# Altium schematic sheet FPGA.SchDoc: iCEVision - FPGA
size A4; Organization: DPControl srl; Address1: via Napoli, 55; Address2: 84014 - Nocera Inf.re; Address3: Salerno; Address4: Italy; Revision: 1; SheetNumber: 1; SheetTotal: 3
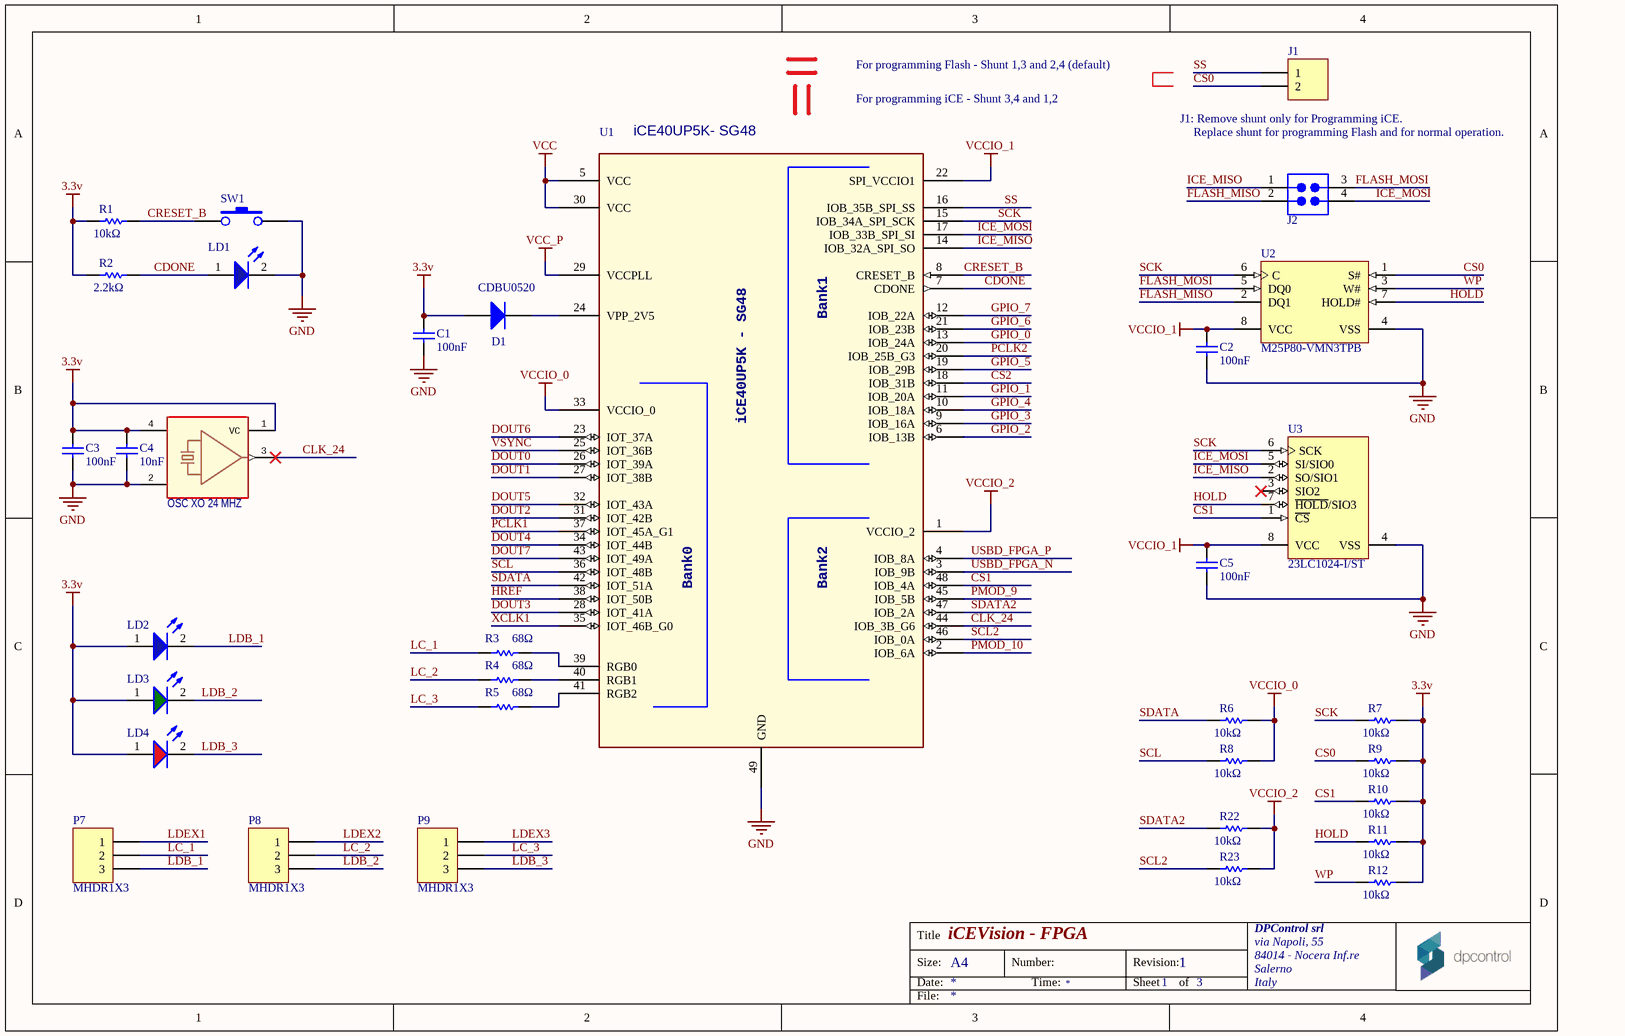
[diagram p0: FPGA.SchDoc]

## Parts
C1  value 100nF  [0603]  (hidden comment: C0603)
C2  value 100nF  [0603]  (hidden comment: C0603)
C3  value 100nF  [0603]  (hidden comment: C0603)
C4  value 10nF  [0603]  (hidden comment: C0603)
C5  value 100nF  [0603]  (hidden comment: C0603)
D1  value CDBU0520  [0603]  (hidden comment: Diode)
J1  WE-2.54 mm Pin Header & Jumper 61300211121  [61300211121]  (value not drawn)
J2  WE-2.54 mm Pin Header & Jumper 61300421121  [61300421121]  (value not drawn)
LD1  150060BS75000  [LED_0603_Blue]  (value not drawn)
LD2  150060BS75000  [LED_0603_Blue]  (value not drawn)
LD3  150060GS75000  [LED_0603_Green]  (value not drawn)
LD4  150060RS75000  [LED_0603_Red]  (value not drawn)
OSC1  OSC XO 24 MHZ  [3.4X2.7-4-PAD]
P7  MHDR1X3  [MHDR1X3]
P8  MHDR1X3  [MHDR1X3]
P9  MHDR1X3  [MHDR1X3]
R1  value 10kΩ  [3-0603]  (hidden comment: ERJ3EK)
R2  value 2.2kΩ  [3-0603]  (hidden comment: ERJ3EK)
R3  value 68Ω  [3-0603]  (hidden comment: ERJ3EK)
R4  value 68Ω  [3-0603]  (hidden comment: ERJ3EK)
R5  value 68Ω  [3-0603]  (hidden comment: ERJ3EK)
R6  value 10kΩ  [3-0603]  (hidden comment: ERJ3EK)
R7  value 10kΩ  [3-0603]  (hidden comment: ERJ3EK)
R8  value 10kΩ  [3-0603]  (hidden comment: ERJ3EK)
R9  value 10kΩ  [3-0603]  (hidden comment: ERJ3EK)
R10  value 10kΩ  [3-0603]  (hidden comment: ERJ3EK)
R11  value 10kΩ  [3-0603]  (hidden comment: ERJ3EK)
R12  value 10kΩ  [3-0603]  (hidden comment: ERJ3EK)
R22  value 10kΩ  [3-0603]  (hidden comment: ERJ3EK)
R23  value 10kΩ  [3-0603]  (hidden comment: ERJ3EK)
SW1  B3U-1000P  [B3U-1000P omron]  (value not drawn)
U1  iCE40UP5K- SG48
U2  M25P80-VMN3TPB  [MICT-MN-8_N]
U3  23LC1024-I/ST  [MCHP-TSSOP-ST8_N]

## Nets
3.3v: C1.2 C3.1 C4.2 D1.1(A) LD2.1(A) LD3.1(A) LD4.1(A) OSC1.1(VC) OSC1.4(VCC) R1.1 R2.1 R7.2 R9.2 R10.2 R11.2 R12.2
GND: C1.1 C2.1 C3.2 C4.1 C5.1 LD1.2(C) OSC1.2(GND) SW1.2 U1.49(GND) U2.4(VSS) U3.4(VSS)
VCC: U1.5(VCC) U1.30(VCC)
VCC_P: U1.29(VCCPLL)
VCCIO_0: R6.2 R8.2 U1.33(VCCIO_0)
VCCIO_1: C2.2 C5.2 U1.22(SPI_VCCIO1) U2.8(VCC) U3.8(VCC)
VCCIO_2: R22.2 R23.2 U1.1(VCCIO_2)
CDONE: LD1.1(A) R2.2 U1.7(CDONE)
CLK_24: OSC1.3(OUT) U1.44(IOB_3B_G6)
CRESET_B: R1.2 SW1.1 U1.8(CRESET_B)
CS0: J1.2 R9.1 U2.1(S#)
CS1: R10.1 U1.48(IOB_4A) U3.1(~{CS})
CS2: U1.18(IOB_31B)
DOUT0: U1.26(IOT_39A)
DOUT1: U1.27(IOT_38B)
DOUT2: U1.31(IOT_42B)
DOUT3: U1.28(IOT_41A)
DOUT4: U1.34(IOT_44B)
DOUT5: U1.32(IOT_43A)
DOUT6: U1.23(IOT_37A)
DOUT7: U1.43(IOT_49A)
FLASH_MISO: J2.2 U2.2(DQ1)
FLASH_MOSI: J2.3 U2.5(DQ0)
GPIO_0: U1.13(IOB_24A)
GPIO_1: U1.11(IOB_20A)
GPIO_2: U1.6(IOB_13B)
GPIO_3: U1.9(IOB_16A)
GPIO_4: U1.10(IOB_18A)
GPIO_5: U1.19(IOB_29B)
GPIO_6: U1.21(IOB_23B)
GPIO_7: U1.12(IOB_22A)
HOLD: R11.1 U2.7(HOLD#) U3.7(~{HOLD}/SIO3)
HREF: U1.38(IOT_50B)
ICE_MISO: J2.1 U1.14(IOB_32A_SPI_SO) U3.2(SO/SIO1)
ICE_MOSI: J2.4 U1.17(IOB_33B_SPI_SI) U3.5(SI/SIO0)
LC_1: P7.2 R3.1
LC_2: P8.2 R4.1
LC_3: P9.2 R5.1
LDB_1: LD2.2(C) P7.3
LDB_2: LD3.2(C) P8.3
LDB_3: LD4.2(C) P9.3
LDEX1: P7.1
LDEX2: P8.1
LDEX3: P9.1
PCLK1: U1.37(IOT_45A_G1)
PCLK2: U1.20(IOB_25B_G3)
PMOD_9: U1.45(IOB_5B)
PMOD_10: U1.2(IOB_6A)
SCK: R7.1 U1.15(IOB_34A_SPI_SCK) U2.6(C) U3.6(SCK)
SCL: R8.1 U1.36(IOT_48B)
SCL2: R23.1 U1.46(IOB_0A)
SDATA: R6.1 U1.42(IOT_51A)
SDATA2: R22.1 U1.47(IOB_2A)
SS: J1.1 U1.16(IOB_35B_SPI_SS)
USBD_FPGA_N: U1.3(IOB_9B)
USBD_FPGA_P: U1.4(IOB_8A)
VSYNC: U1.25(IOT_36B)
WP: R12.1 U2.3(W#)
XCLK1: U1.35(IOT_46B_G0)
NetD1_2: D1.2(K) U1.24(VPP_2V5)
NetR3_2: R3.2 U1.39(RGB0)
NetR4_2: R4.2 U1.40(RGB1)
NetR5_2: R5.2 U1.41(RGB2)

Not connected (* = marked no-connect by the designer): U3 3(SIO2)*

## Notes on the sheet
- For programming Flash - Shunt 1,3 and 2,4 (default)
- For programming iCE - Shunt 3,4 and 1,2
- (near J1) J1: Remove shunt only for Programming iCE.
- Replace shunt for programming Flash and for normal operation.
- Title
- Size:
- Date:
- A4
- Number:
- Time:
- Revision:
- Sheet
- of
- File:
- (in symbol iCE40UP5K- SG48) Bank1; iCE40UP5K - SG48; Bank0; Bank2

## Library data of the parts
C1-C3 C5 = C0603: Ceramic Chip Capacitor - Standard; Part No: C0603C104K8RACTU; MPN: GPC0603104; Note: Footprint corresponds to dimensions for bulk cassette packaging. This case size has tightened tolerances.; Published: 17-Jul-2002; LatestRevisionNote: Silkscreen size reduced.; DatasheetDocument: Mar-2001; PackageDocument: Mar-2001; PackageReference: 0603; Publisher: Altium Limited; Code_JEITA: 0603; Code_IPC: 1608 [0603]; ComponentLink1Description: Manufacturer Link; ComponentLink1URL: http://www.kemet.com/; ComponentLink2Description: Datasheet; ComponentLink2URL: http://www.kemet.com/kemet/web/homepage/kechome.nsf/vapubfilesname/F3102TA.pdf/$file/F3102TA.pdf
C4 = C0603: Ceramic Chip Capacitor - Standard; Part No: C0603C103K5RACTU; MPN: GPC0603103; Note: Footprint corresponds to dimensions for bulk cassette packaging. This case size has tightened tolerances.; Published: 17-Jul-2002; LatestRevisionNote: Silkscreen size reduced.; DatasheetDocument: Mar-2001; PackageDocument: Mar-2001; PackageReference: 0603; Publisher: Altium Limited; Code_JEITA: 0603; Code_IPC: 1608 [0603]; ComponentLink1Description: Manufacturer Link; ComponentLink1URL: http://www.kemet.com/; ComponentLink2Description: Datasheet; ComponentLink2URL: http://www.kemet.com/kemet/web/homepage/kechome.nsf/vapubfilesname/F3102TA.pdf/$file/F3102TA.pdf
D1 = Diode: Default Diode; Manufacturer: COMCHIP TECHNOLOGY; Published: 8-Jun-2000; LatestRevisionDate: 17-Jul-2002; LatestRevisionNote: Re-released for DXP Platform.; PackageVersion: Sep-1996; PackageReference: SOD-523F (0603); Publisher: Altium Limited; PackageDescription: SOD-523F (0603); Code_JEDEC: DO-214-AB; MPN: CDBU0520
J1 = WE-2.54 mm Pin Header & Jumper 61300211121: WR-PHD 2.54mm Pin Header; Manufacturer: W¨¹rth Elektronik eiSos GmbH; ComponentLink1 Description: Manufacturer; ComponentLink2 Description: Datasheet; NoPins: 02; Created Date: 22 March 2013; partNo: 61300211121; ComponentLink1URL: http://www.we-online.com; ComponentLink2URL: http://katalog.we-online.de/em/datasheet/6130xx11121.pdf; Created by: Karrer Zheng
J2 = WE-2.54 mm Pin Header & Jumper 61300421121: WR-PHD 2.54 mm Dual Pin Header; Manufacturer: W¨¹rth Elektronik eiSos GmbH; ComponentLink1 Description: Manufacturer; ComponentLink2 Description: Datasheet; NoPins: 04; Created Date: 25 March 2013; partNo: 61300421121; ComponentLink1URL: http://www.we-online.com; ComponentLink2URL: http://katalog.we-online.de/em/datasheet/6130xx21121.pdf; Created by: Karrer Zheng
LD1 LD2 = WL-SMCW 0603  150060BS75000: SMD mono-color Chip LED, WL-SMCW, Blue; Manufacturer: W黵th Elektronik eiSos GmbH; PartNo: 150060BS75000; ComponentLink1Description: Manufacturer; ComponentLink1URL: http://www.we-online.de; Created by: Christin Otto; Created Date: June 2013; ComponentLink2Description: Datasheet; ComponentLink2URL: http://katalog.we-online.com/led/datasheet/150060BS75000.pdf; Color: Blue; MPN: 150060BS75000
LD3 = WL-SMCW 0603  150060GS75000: SMD mono-color Chip LED, WL-SMCW, Green; Manufacturer: W黵th Elektronik eiSos GmbH; PartNo: 150060GS75000; ComponentLink1Description: Manufacturer; ComponentLink1URL: http://www.we-online.de; Created by: Christin Otto; Created Date: June 2013; ComponentLink2Description: Datasheet; ComponentLink2URL: http://katalog.we-online.com/led/datasheet/150060GS75000.pdf; Color: Green; MPN: 150060GS75000
LD4 = WL-SMCW 0603  150060RS75000: SMD mono-color Chip LED, WL-SMCW, Red; Manufacturer: W黵th Elektronik eiSos GmbH; PartNo: 150060RS75000; ComponentLink1Description: Manufacturer; ComponentLink1URL: http://www.we-online.de; Created by: Christin Otto; Created Date: June 2013; ComponentLink2Description: Datasheet; ComponentLink2URL: http://katalog.we-online.com/led/datasheet/150060RS75000.pdf; Color: Red; MPN: 150060RS75000
OSC1 = TCXO-CFPT-9301: Manufacturer: Abracon LLC; Part No: LFSPXO025558; MPN: 7M-24.000MAAJ-T; Value: ASFL1-24.000MHZ-EK-T; Supplier 1: Allied; Distributor: RS Components
P7-P9 = MHDR1X3: Header, 3-Pin; LatestRevisionDate: 17-Jul-2002; LatestRevisionNote: Re-released for DXP Platform.; Publisher: Altium Limited
R1 R6-R12 R22 R23 = ERJ3EK: Precision Thick Film Chip Resistor, 10 Ohm to 1M Ohm Range, 1% and 0.5% Tolerance, 0603 Size, 0.063 W; Part No: ERJ3EKF1002V; MPN: GPR060310K; Published: 17-Dec-2003; LatestRevisionDate: 19-Mar-2004; LatestRevisionNote: Silkscreen size reduced.; PackageDocument: Mar-2003; PackageReference: 3-0603; Publisher: Altium Limited; Code_IPC: 1608 [0603]; ComponentLink1Description: Manufacturer Link; ComponentLink1URL: http://www.panasonic.com/industrial/components/resistive_products.htm; ComponentLink2Description: Datasheet; ComponentLink2URL: http://www.panasonic.com/industrial/components/pdf/AOA0000CE2.pdf
R2 = ERJ3EK: Precision Thick Film Chip Resistor, 10 Ohm to 1M Ohm Range, 1% and 0.5% Tolerance, 0603 Size, 0.063 W; Part No: ERA3ARB222V; MPN: GPR06032K2; Published: 17-Dec-2003; LatestRevisionDate: 19-Mar-2004; LatestRevisionNote: Silkscreen size reduced.; PackageDocument: Mar-2003; PackageReference: 3-0603; Publisher: Altium Limited; Code_IPC: 1608 [0603]; ComponentLink1Description: Manufacturer Link; ComponentLink1URL: http://www.panasonic.com/industrial/components/resistive_products.htm; ComponentLink2Description: Datasheet; ComponentLink2URL: http://www.panasonic.com/industrial/components/pdf/AOA0000CE2.pdf
R3-R5 = ERJ3EK: Precision Thick Film Chip Resistor, 10 Ohm to 1M Ohm Range, 1% and 0.5% Tolerance, 0603 Size, 0.063 W; Part No: ERJPA3F68R0V; MPN: GPR060368R; LatestRevisionDate: 19-Mar-2004; LatestRevisionNote: Silkscreen size reduced.; PackageDocument: Mar-2003; PackageReference: 3-0603; Publisher: Altium Limited; Code_IPC: 1608 [0603]; ComponentLink1Description: Manufacturer Link; ComponentLink1URL: http://www.panasonic.com/industrial/components/resistive_products.htm; ComponentLink2Description: Datasheet; ComponentLink2URL: http://www.panasonic.com/industrial/components/pdf/AOA0000CE2.pdf
SW1 = SW-PB: Tact Switch; MAN: Omron; DIST: Farnell; DIST PN: 1333652RL; MAN PN: B3U-1000P; ICCO PN: B3U-1000P; MPN: B3U-1000P
U1 = iCE40UP5K- SG48: MPN: ICE40UP5K-SG48ITR50
U2 = M25P80-VMN3TPB: 8 Mb (x1) Automotive Serial NOR Flash Memory, 75 MHz, 2.7 to 3.6 V, 8-pin SO8 Narrow (MN), Tape & Reel; Part Family: M25P; Manufacturer: Micron; MPN: MX25L8006EM2I-12G; Density: 8Mb; Speed: 75 MHz; Voltage: 2.7V-3.6V; DatasheetVersion: Rev. Y; PackageVersion: Rev 11; PackageReference: MICT-MN-8; PackageDescription: 8-Pin SO Narrow, 3.9 X 4.9 mm, Pitch 1.27 mm; Applications: Automotive; Package: SO8 Narrow; Part Status: Production; RoHS: Yes; Type: Data Storage; Width: x1; Mounting Technology: Surface Mount; PartNumber: M25P80-VMN3TPB; ComponentLink1Description: Manufacturer URL; ComponentLink1URL: http://www.micron.com/; ComponentLink2Description: Datasheet; ComponentLink2URL: http://www.micron.com/~/media/Documents/Products/Data%20Sheet/NOR%20Flash/Serial%20NOR/M25P/M25P80.pdf; ComponentLink3Description: Package Specification; ComponentLink3URL: http://www.micron.com/~/media/Documents/Products/Data%20Sheet/NOR%20Flash/Serial%20NOR/M25P/M25P05A.pdf
U3 = 23LC1024-I/ST: 1024K bits SPI Serial SRAM with SDI and SQI Interface, 2.5 to 5.5 V, 20 MHz, -40 to 85 degC, 8-pin TSSOP (ST8), Tube; Manufacturer: Microchip; DatasheetVersion: Rev. A; PackageVersion: C04-086B; PackageReference: TSSOP-ST8; PackageDescription: 8-Lead Plastic Thin Shrink Small Outline, 3 x 4.4 mm Body, 0.65 mm Pitch; Supplier 1: Digi-Key; Supplier Part Number 1: 23LC1024-I/ST-ND; Supplier 2: Farnell; Supplier Part Number 2: 2212151; Supplier 3: Newark; Supplier Part Number 3: 94T8232; Supplier 4: Newark; Supplier Part Number 4: 45W1402; Supplier 5: Mouser; Supplier Part Number 5: 579-23LC1024-I/ST; Mounting Technology: Surface Mount; PartNumber: 23LC1024-I/ST; ComponentLink1Description: Manufacturer URL; ComponentLink1URL: http://www.microchip.com; ComponentLink2Description: Datasheet; ComponentLink2URL: http://ww1.microchip.com/downloads/en/DeviceDoc/25142A.pdf; ComponentLink3Description: Package Specification; ComponentLink3URL: http://www.microchip.com/stellent/groups/techpub_sg/documents/packagingspec/en012702.pdf; ComponentLink4Description: Product URL; ComponentLink4URL: http://www.microchip.com/23LC1024; MPN: 23LC1024-I/ST